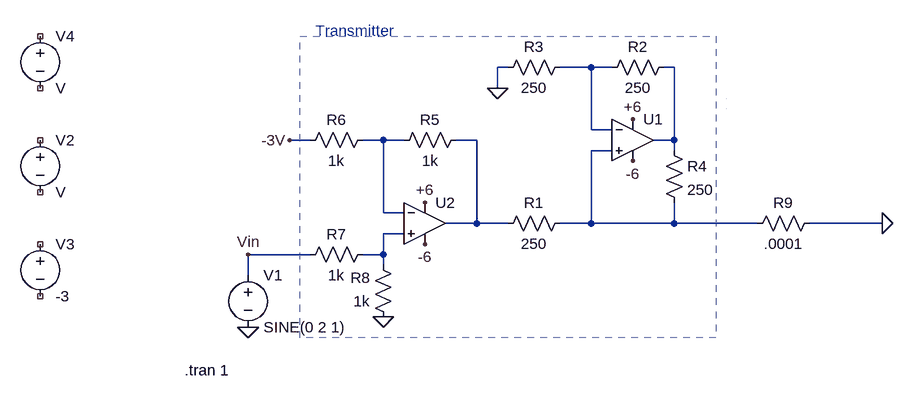
[diagram p0: schematic Draft2.asc]
Draft2.asc, the LTspice schematic file:
Version 4
SHEET 1 880 680
WIRE 272 -128 256 -128
WIRE 400 -128 352 -128
WIRE 432 -128 400 -128
WIRE 528 -128 512 -128
WIRE 256 -96 256 -128
WIRE 400 -32 400 -128
WIRE 432 -32 400 -32
WIRE -32 -16 -64 -16
WIRE 80 -16 48 -16
WIRE 112 -16 80 -16
WIRE 224 -16 192 -16
WIRE 528 -16 528 -128
WIRE 528 -16 496 -16
WIRE 432 0 400 0
WIRE 528 0 528 -16
WIRE 80 96 80 -16
WIRE 112 96 80 96
WIRE 224 112 224 -16
WIRE 224 112 176 112
WIRE 272 112 224 112
WIRE 400 112 400 0
WIRE 400 112 352 112
WIRE 528 112 528 80
WIRE 528 112 400 112
WIRE 656 112 528 112
WIRE 848 112 736 112
WIRE 112 128 80 128
WIRE -32 160 -128 160
WIRE 80 160 80 128
WIRE 80 160 48 160
WIRE 80 176 80 160
WIRE -128 192 -128 160
FLAG 256 -96 0
FLAG 144 80 +6
FLAG 144 144 -6
FLAG -128 272 0
FLAG 80 256 0
FLAG 464 16 -6
FLAG 464 -48 +6
FLAG -64 -16 -3V
FLAG -128 160 Vin
FLAG 848 112 0
SYMBOL OpAmps\\UniversalOpamp2 464 -16 R0
SYMATTR InstName U1
SYMBOL res 368 96 R90
WINDOW 0 0 56 VBottom 2
WINDOW 3 32 56 VTop 2
SYMATTR InstName R1
SYMATTR Value 250
SYMBOL res 528 -144 R90
WINDOW 0 0 56 VBottom 2
WINDOW 3 32 56 VTop 2
SYMATTR InstName R2
SYMATTR Value 250
SYMBOL res 368 -144 R90
WINDOW 0 0 56 VBottom 2
WINDOW 3 32 56 VTop 2
SYMATTR InstName R3
SYMATTR Value 250
SYMBOL res 512 -16 R0
SYMATTR InstName R4
SYMATTR Value 250
SYMBOL OpAmps\\UniversalOpamp2 144 112 R0
SYMATTR InstName U2
SYMBOL res 208 -32 R90
WINDOW 0 0 56 VBottom 2
WINDOW 3 32 56 VTop 2
SYMATTR InstName R5
SYMATTR Value 1k
SYMBOL res 64 -32 R90
WINDOW 0 0 56 VBottom 2
WINDOW 3 32 56 VTop 2
SYMATTR InstName R6
SYMATTR Value 1k
SYMBOL res 64 144 R90
WINDOW 0 0 56 VBottom 2
WINDOW 3 32 56 VTop 2
SYMATTR InstName R7
SYMATTR Value 1k
SYMBOL res 96 272 R180
WINDOW 0 36 76 Left 2
WINDOW 3 36 40 Left 2
SYMATTR InstName R8
SYMATTR Value 1k
SYMBOL voltage -128 176 R0
WINDOW 123 0 0 Left 0
WINDOW 39 0 0 Left 0
SYMATTR InstName V1
SYMATTR Value SINE(0 2 1)
SYMBOL res 752 96 R90
WINDOW 0 0 56 VBottom 2
WINDOW 3 32 56 VTop 2
SYMATTR InstName R9
SYMATTR Value .0001
SYMBOL voltage -448 -32 R0
SYMATTR InstName V2
SYMBOL voltage -448 128 R0
WINDOW 123 0 0 Left 0
WINDOW 39 0 0 Left 0
SYMATTR InstName V3
SYMATTR Value -3
SYMBOL voltage -448 -192 R0
SYMATTR InstName V4
TEXT -226 338 Left 2 !.tran 1
TEXT -24 -184 Left 2 ;Transmitter
RECTANGLE Normal 608 -80 608 -80 2
RECTANGLE Normal 608 -64 608 -64 2
RECTANGLE Normal 592 288 -48 -176 2

The netlist it stands for:
* Draft2.asc
XU1 N005 N001 +6 -6 N002 level.2 Avol=1Meg GBW=10Meg Slew=10Meg ilimit=25m rail=0 Vos=0 phimargin=45 en=0 enk=0 in=0 ink=0 Rin=500Meg  ; pins IN+ IN- V+ V- OUT
R1 N005 N004 250
R2 N002 N001 250
R3 N001 0 250
R4 N002 N005 250
XU2 N006 N003 +6 -6 N004 level.2 Avol=1Meg GBW=10Meg Slew=10Meg ilimit=25m rail=0 Vos=0 phimargin=45 en=0 enk=0 in=0 ink=0 Rin=500Meg  ; pins IN+ IN- V+ V- OUT
R5 N004 N003 1k
R6 N003 -3V 1k
R7 N006 Vin 1k
R8 0 N006 1k
V1 Vin 0 SINE(0 2 1)
R9 0 N005 .0001
V2 NC_01 NC_02 V
V3 NC_03 NC_04 -3
V4 NC_05 NC_06 V
.tran 1
* Transmitter
.lib UniversalOpamps2.sub
.backanno
.end